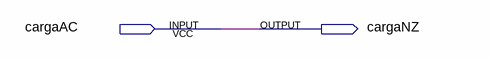
[diagram p0: schematic sheet]
// Quartus schematic carga_nz.bdf as structural Verilog: 0 symbols, 2 pins
module carga_nz (
  input  cargaAC,
  output cargaNZ
);


  assign cargaNZ = cargaAC;
endmodule
